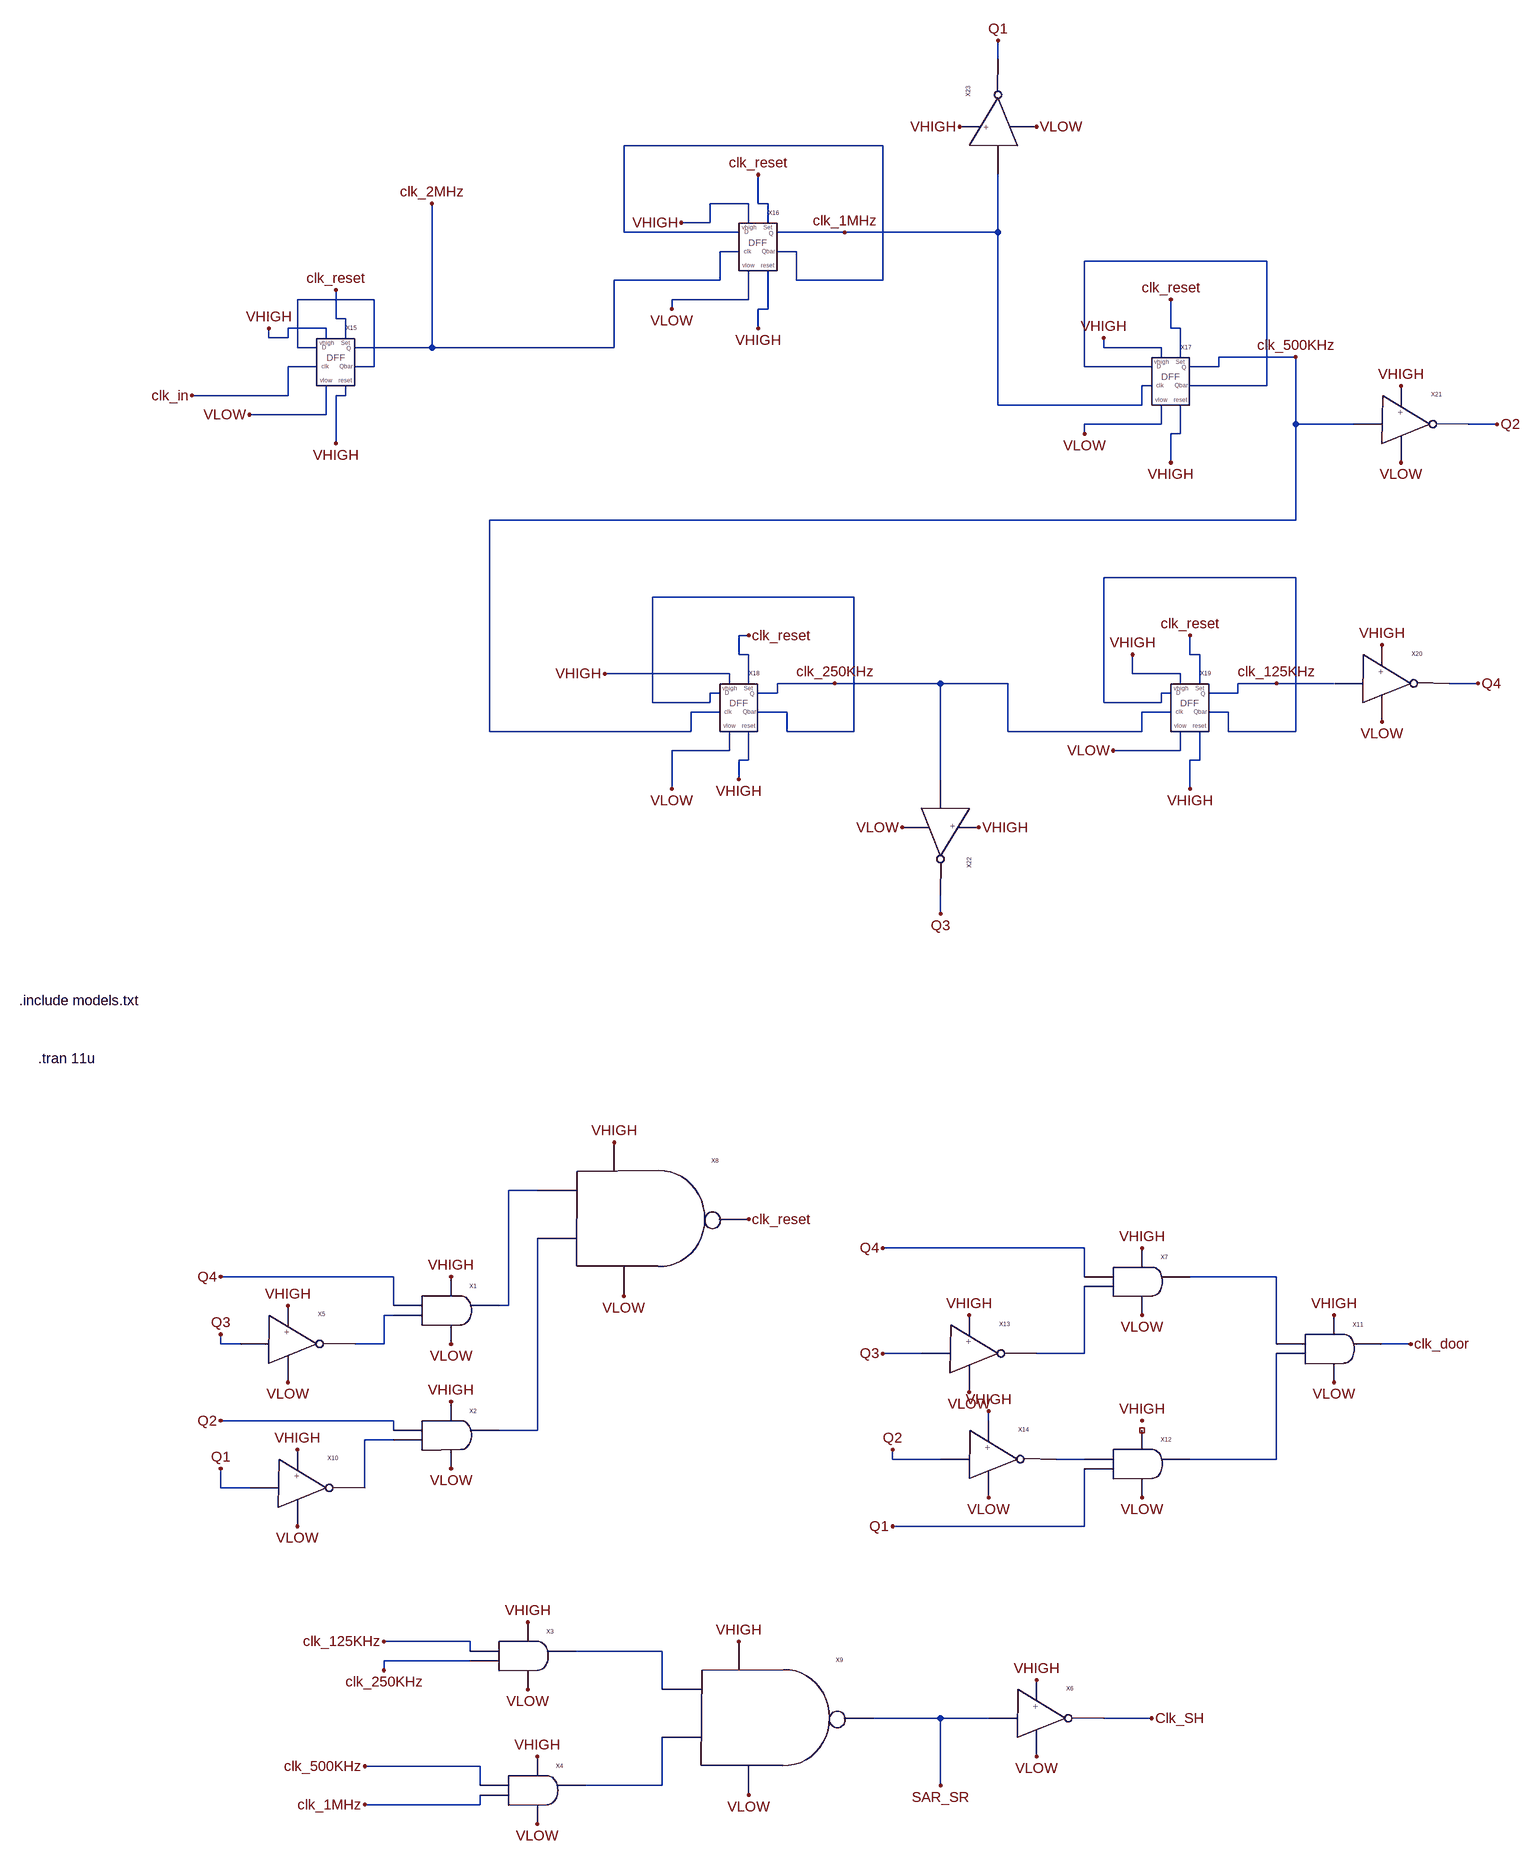
[diagram p0: schematic Clock_half.asc]
Clock_half.asc, the LTspice schematic file:
Version 4
SHEET 1 1968 1268
WIRE 1088 -2416 1088 -2448
WIRE 896 -2272 464 -2272
WIRE 672 -2176 608 -2176
WIRE 688 -2176 688 -2224
WIRE 704 -2176 688 -2176
WIRE 608 -2144 608 -2176
WIRE 608 -2144 560 -2144
WIRE 672 -2144 672 -2176
WIRE 704 -2144 704 -2176
WIRE 464 -2128 464 -2272
WIRE 656 -2128 464 -2128
WIRE 832 -2128 720 -2128
WIRE 1088 -2128 1088 -2224
WIRE 1088 -2128 832 -2128
WIRE 656 -2096 624 -2096
WIRE 752 -2096 720 -2096
WIRE 1536 -2080 1232 -2080
WIRE 624 -2048 624 -2096
WIRE 624 -2048 448 -2048
WIRE 752 -2048 752 -2096
WIRE 896 -2048 896 -2272
WIRE 896 -2048 752 -2048
WIRE 48 -2016 -80 -2016
WIRE 672 -2016 672 -2064
WIRE 672 -2016 544 -2016
WIRE 544 -2000 544 -2016
WIRE 704 -2000 704 -2064
WIRE 704 -2000 688 -2000
WIRE -16 -1984 -16 -2032
WIRE 0 -1984 -16 -1984
WIRE -32 -1968 -96 -1968
WIRE 688 -1968 688 -2000
WIRE 1376 -1968 1376 -2016
WIRE 1392 -1968 1376 -1968
WIRE -128 -1952 -128 -1968
WIRE -96 -1952 -96 -1968
WIRE -96 -1952 -128 -1952
WIRE -32 -1952 -32 -1968
WIRE 0 -1952 0 -1984
WIRE -80 -1936 -80 -2016
WIRE -48 -1936 -80 -1936
WIRE 144 -1936 144 -2176
WIRE 144 -1936 16 -1936
WIRE 448 -1936 448 -2048
WIRE 448 -1936 144 -1936
WIRE 1264 -1936 1264 -1952
WIRE 1360 -1936 1264 -1936
WIRE 1360 -1920 1360 -1936
WIRE 1392 -1920 1392 -1968
WIRE 1584 -1920 1456 -1920
WIRE -48 -1904 -96 -1904
WIRE 48 -1904 48 -2016
WIRE 48 -1904 16 -1904
WIRE 1232 -1904 1232 -2080
WIRE 1344 -1904 1232 -1904
WIRE 1456 -1904 1456 -1920
WIRE 1456 -1904 1408 -1904
WIRE 1344 -1872 1328 -1872
WIRE 1536 -1872 1536 -2080
WIRE 1536 -1872 1408 -1872
WIRE -96 -1856 -96 -1904
WIRE -96 -1856 -256 -1856
WIRE 0 -1856 0 -1872
WIRE 0 -1856 -16 -1856
WIRE 1088 -1840 1088 -2128
WIRE 1328 -1840 1328 -1872
WIRE 1328 -1840 1088 -1840
WIRE -32 -1824 -32 -1872
WIRE -32 -1824 -160 -1824
WIRE 1360 -1808 1360 -1840
WIRE 1360 -1808 1232 -1808
WIRE 1584 -1808 1584 -1920
WIRE 1680 -1808 1584 -1808
WIRE 1920 -1808 1872 -1808
WIRE 1232 -1792 1232 -1808
WIRE 1392 -1792 1392 -1840
WIRE 1392 -1792 1376 -1792
WIRE -16 -1776 -16 -1856
WIRE 1376 -1744 1376 -1792
WIRE 1584 -1648 1584 -1808
WIRE 1584 -1648 240 -1648
WIRE 1584 -1552 1264 -1552
WIRE 848 -1520 512 -1520
WIRE 672 -1456 656 -1456
WIRE 656 -1424 656 -1456
WIRE 672 -1424 656 -1424
WIRE 1408 -1424 1408 -1456
WIRE 1424 -1424 1408 -1424
WIRE 640 -1392 432 -1392
WIRE 1312 -1392 1312 -1424
WIRE 1392 -1392 1312 -1392
WIRE 640 -1376 640 -1392
WIRE 672 -1376 672 -1424
WIRE 816 -1376 720 -1376
WIRE 992 -1376 816 -1376
WIRE 1104 -1376 992 -1376
WIRE 1392 -1376 1392 -1392
WIRE 1424 -1376 1424 -1424
WIRE 1552 -1376 1488 -1376
WIRE 1648 -1376 1552 -1376
WIRE 1888 -1376 1840 -1376
WIRE 624 -1360 608 -1360
WIRE 720 -1360 720 -1376
WIRE 720 -1360 688 -1360
WIRE 1376 -1360 1360 -1360
WIRE 1488 -1360 1488 -1376
WIRE 1488 -1360 1440 -1360
WIRE 512 -1344 512 -1520
WIRE 608 -1344 608 -1360
WIRE 608 -1344 512 -1344
WIRE 1264 -1344 1264 -1552
WIRE 1360 -1344 1360 -1360
WIRE 1360 -1344 1264 -1344
WIRE 624 -1328 576 -1328
WIRE 736 -1328 688 -1328
WIRE 1376 -1328 1328 -1328
WIRE 1472 -1328 1440 -1328
WIRE 240 -1296 240 -1648
WIRE 576 -1296 576 -1328
WIRE 576 -1296 240 -1296
WIRE 736 -1296 736 -1328
WIRE 848 -1296 848 -1520
WIRE 848 -1296 736 -1296
WIRE 1104 -1296 1104 -1376
WIRE 1328 -1296 1328 -1328
WIRE 1328 -1296 1104 -1296
WIRE 1472 -1296 1472 -1328
WIRE 1584 -1296 1584 -1552
WIRE 1584 -1296 1472 -1296
WIRE 640 -1264 640 -1296
WIRE 640 -1264 544 -1264
WIRE 1392 -1264 1392 -1296
WIRE 1392 -1264 1280 -1264
WIRE 672 -1248 672 -1296
WIRE 672 -1248 656 -1248
WIRE 1424 -1248 1424 -1296
WIRE 1424 -1248 1408 -1248
WIRE 656 -1216 656 -1248
WIRE 992 -1216 992 -1376
WIRE 544 -1200 544 -1264
WIRE 1408 -1200 1408 -1248
WIRE 992 -992 992 -1024
WIRE 320 -144 272 -144
WIRE 1232 -48 896 -48
WIRE 80 0 -208 0
WIRE 1232 0 1232 -48
WIRE 1552 0 1408 0
WIRE 80 48 80 0
WIRE 272 48 272 -144
WIRE 272 48 256 48
WIRE 80 64 64 64
WIRE -208 112 -208 96
WIRE -176 112 -208 112
WIRE 64 112 64 64
WIRE 64 112 16 112
WIRE 1552 112 1552 0
WIRE 1776 112 1728 112
WIRE 960 128 896 128
WIRE 1232 128 1232 16
WIRE 1232 128 1152 128
WIRE 80 240 -208 240
WIRE 1072 240 1072 224
WIRE 80 256 80 240
WIRE 320 256 320 -64
WIRE 320 256 256 256
WIRE 80 272 32 272
WIRE 912 304 912 288
WIRE 992 304 912 304
WIRE 1232 304 1184 304
WIRE 1552 304 1552 128
WIRE 1552 304 1408 304
WIRE -208 352 -208 320
WIRE -160 352 -208 352
WIRE 32 352 32 272
WIRE 1232 416 1232 320
WIRE 1232 416 912 416
WIRE 208 848 64 848
WIRE 208 864 208 848
WIRE 528 864 384 864
WIRE 208 880 64 880
WIRE 64 896 64 880
WIRE 528 928 528 864
WIRE 992 976 880 976
WIRE 1072 976 992 976
WIRE 1344 976 1264 976
WIRE 224 1056 32 1056
WIRE 224 1088 224 1056
WIRE 528 1088 528 1008
WIRE 528 1088 400 1088
WIRE 992 1088 992 976
WIRE 224 1120 224 1104
WIRE 224 1120 32 1120
FLAG 448 -224 VHIGH
FLAG 176 0 VHIGH
FLAG 176 208 VHIGH
FLAG 304 816 VHIGH
FLAG 320 1040 VHIGH
FLAG 656 848 VHIGH
FLAG 176 112 VLOW
FLAG 176 320 VLOW
FLAG 464 32 VLOW
FLAG 304 928 VLOW
FLAG 320 1152 VLOW
FLAG 672 1104 VLOW
FLAG -208 0 Q4
FLAG -208 96 Q3
FLAG -208 240 Q2
FLAG -208 320 Q1
FLAG 64 848 clk_125KHz
FLAG 64 896 clk_250KHz
FLAG 32 1056 clk_500KHz
FLAG 32 1120 clk_1MHz
FLAG -80 288 VHIGH
FLAG -80 416 VLOW
FLAG -96 48 VHIGH
FLAG -96 176 VLOW
FLAG 672 -96 clk_reset
FLAG 1152 912 VHIGH
FLAG 1152 1040 VLOW
FLAG 992 1088 SAR_SR
FLAG 1344 976 Clk_SH
FLAG 896 -48 Q4
FLAG 896 128 Q3
FLAG 912 288 Q2
FLAG 912 416 Q1
FLAG 1072 224 VHIGH
FLAG 1328 240 VHIGH
FLAG 1040 64 VHIGH
FLAG 1328 -48 VHIGH
FLAG 1648 64 VHIGH
FLAG 1040 192 VLOW
FLAG 1072 368 VLOW
FLAG 1328 368 VLOW
FLAG 1328 64 VLOW
FLAG 1648 176 VLOW
FLAG 1776 112 clk_door
FLAG 432 -1392 VHIGH
FLAG 656 -1216 VHIGH
FLAG 544 -1200 VLOW
FLAG 672 -1456 clk_reset
FLAG 992 -992 Q3
FLAG 1888 -1376 Q4
FLAG 1920 -1808 Q2
FLAG 1088 -2448 Q1
FLAG 1056 -1136 VHIGH
FLAG 1728 -1440 VHIGH
FLAG 1760 -1872 VHIGH
FLAG 1024 -2304 VHIGH
FLAG 1152 -2304 VLOW
FLAG 1760 -1744 VLOW
FLAG 1728 -1312 VLOW
FLAG 928 -1136 VLOW
FLAG 1280 -1264 VLOW
FLAG 1408 -1200 VHIGH
FLAG 1312 -1424 VHIGH
FLAG 1408 -1456 clk_reset
FLAG -128 -1968 VHIGH
FLAG -16 -1776 VHIGH
FLAG 688 -1968 VHIGH
FLAG 560 -2144 VHIGH
FLAG 1376 -1744 VHIGH
FLAG 1264 -1952 VHIGH
FLAG -160 -1824 VLOW
FLAG 544 -2000 VLOW
FLAG 1232 -1792 VLOW
FLAG -16 -2032 clk_reset
FLAG 688 -2224 clk_reset
FLAG 1376 -2016 clk_reset
FLAG -256 -1856 clk_in
FLAG 144 -2176 clk_2MHz
FLAG 832 -2128 clk_1MHz
FLAG 1584 -1920 clk_500KHz
FLAG 816 -1376 clk_250KHz
FLAG 1552 -1376 clk_125KHz
SYMBOL AND 224 64 R0
SYMATTR InstName X1
SYMBOL AND 224 272 R0
SYMATTR InstName X2
SYMBOL AND 352 880 R0
SYMATTR InstName X3
SYMBOL AND 368 1104 R0
SYMATTR InstName X4
SYMBOL inverter -80 352 R0
SYMATTR InstName X10
SYMBOL inverter -96 112 R0
SYMATTR InstName X5
SYMBOL inverter 1152 976 R0
SYMATTR InstName X6
SYMBOL AND 1376 16 R0
SYMATTR InstName X7
SYMBOL AND 1696 128 R0
SYMATTR InstName X11
SYMBOL AND 1376 320 R0
SYMATTR InstName X12
SYMBOL inverter 1040 128 R0
SYMATTR InstName X13
SYMBOL inverter 1072 304 R0
SYMATTR InstName X14
SYMBOL DFF 32 -1920 R0
SYMATTR InstName X15
SYMBOL DFF 736 -2112 R0
SYMATTR InstName X16
SYMBOL DFF 1424 -1888 R0
SYMATTR InstName X17
SYMBOL DFF 704 -1344 R0
SYMATTR InstName X18
SYMBOL DFF 1456 -1344 R0
SYMATTR InstName X19
SYMBOL inverter 1728 -1376 R0
SYMATTR InstName X20
SYMBOL inverter 1760 -1808 R0
SYMATTR InstName X21
SYMBOL inverter 992 -1136 R90
SYMATTR InstName X22
SYMBOL inverter 1088 -2304 R270
SYMATTR InstName X23
SYMBOL 2NAND 432 -96 R0
SYMATTR InstName X8
SYMBOL 2NAND 640 976 R0
SYMATTR InstName X9
TEXT -544 -832 Left 2 !.include models.txt
TEXT -512 -736 Left 2 !.tran 11u

The netlist it stands for:
* Clock_half.asc
XX1 Q4 N008 VHIGH VLOW N006 AND  ; pins A B VHIGH VLOW Vout
XX2 Q2 N011 VHIGH VLOW N010 AND  ; pins A B VHIGH VLOW Vout
XX3 clk_125KHz clk_250KHz VHIGH VLOW N014 AND  ; pins A B VHIGH VLOW Vout
XX4 clk_500KHz clk_1MHz VHIGH VLOW N015 AND  ; pins A B VHIGH VLOW Vout
XX10 Q1 VHIGH VLOW N011 inverter  ; pins Vin VHIGH VLOW Vout
XX5 Q3 VHIGH VLOW N008 inverter  ; pins Vin VHIGH VLOW Vout
XX6 SAR_SR VHIGH VLOW Clk_SH inverter  ; pins Vin VHIGH VLOW Vout
XX7 Q4 N009 VHIGH VLOW N007 AND  ; pins A B VHIGH VLOW Vout
XX11 N007 N013 VHIGH VLOW clk_door AND  ; pins A B VHIGH VLOW Vout
XX12 N012 Q1 NC_01 VLOW N013 AND  ; pins A B VHIGH VLOW Vout
XX13 Q3 VHIGH VLOW N009 inverter  ; pins Vin VHIGH VLOW Vout
XX14 Q2 VHIGH VLOW N012 inverter  ; pins Vin VHIGH VLOW Vout
XX15 N003 clk_in VHIGH VLOW clk_reset VHIGH clk_2MHz N003 DFF  ; pins D clk VHIGH VLOW set_b reset_b Q Qbar
XX16 N001 clk_2MHz VHIGH VLOW clk_reset VHIGH clk_1MHz N001 DFF  ; pins D clk VHIGH VLOW set_b reset_b Q Qbar
XX17 N002 clk_1MHz VHIGH VLOW clk_reset VHIGH clk_500KHz N002 DFF  ; pins D clk VHIGH VLOW set_b reset_b Q Qbar
XX18 N005 clk_500KHz VHIGH VLOW clk_reset VHIGH clk_250KHz N005 DFF  ; pins D clk VHIGH VLOW set_b reset_b Q Qbar
XX19 N004 clk_250KHz VHIGH VLOW clk_reset VHIGH clk_125KHz N004 DFF  ; pins D clk VHIGH VLOW set_b reset_b Q Qbar
XX20 clk_125KHz VHIGH VLOW Q4 inverter  ; pins Vin VHIGH VLOW Vout
XX21 clk_500KHz VHIGH VLOW Q2 inverter  ; pins Vin VHIGH VLOW Vout
XX22 clk_250KHz VHIGH VLOW Q3 inverter  ; pins Vin VHIGH VLOW Vout
XX23 clk_1MHz VHIGH VLOW Q1 inverter  ; pins Vin VHIGH VLOW Vout
XX8 N006 N010 clk_reset VHIGH VLOW 2NAND  ; pins A B Vout VHIGH VLOW
XX9 N014 N015 SAR_SR VHIGH VLOW 2NAND  ; pins A B Vout VHIGH VLOW
.include models.txt
.tran 11u
.backanno
.end